# Altium project Zynq-Video-Board-Rev-1.2.PrjPCB (part 2 of 2)
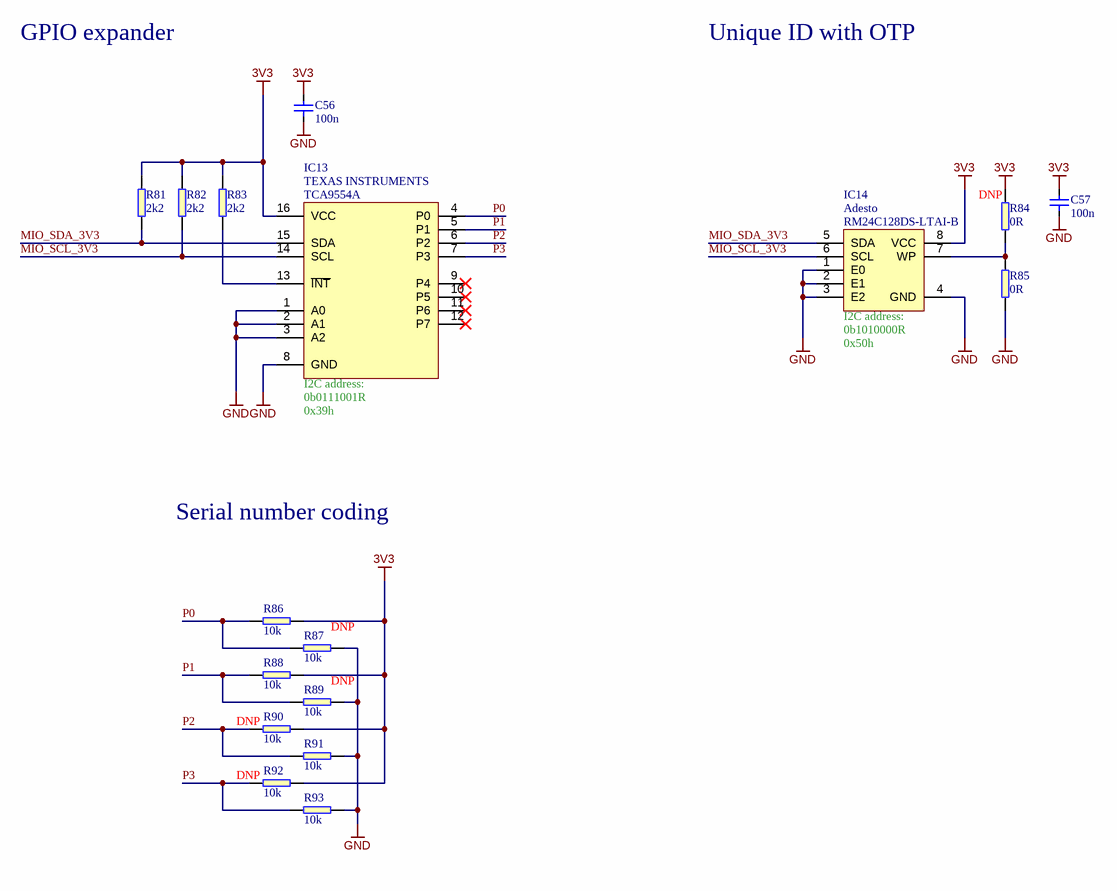
[diagram p9: [9]_ID_Serial.SchDoc]

## Nets that join several sheets
2V8: [1]_Power Supply (R2.2), [7]_CSI (IC10.1 IC10.8 IC12.1 IC12.8)
3V3: [1]_Power Supply (Q1.2 R9.2 R10.2), [2]_Ethernet_SDCard (11 pins), [3]_SO-DIMM (10 pins), [4]_USB (9 pins), [5]_HDMI (5 pins), [6]_Debug (9 pins), [7]_CSI (6 pins), [8]_Peripherals (8 pins), [9]_ID_Serial (12 pins)
3V3_MOD: [1]_Power Supply (L3.1 L6.1 L7.1 Q1.3), [3]_SO-DIMM (R20.2)
5V0: [1]_Power Supply (C1.2 IC1.1 IC1.3 R3.2), [3]_SO-DIMM (C58.2 FAN.1 R94.1), [4]_USB (C52.2 IC5.7), [5]_HDMI (C29.1 IC7.11), [6]_Debug (D3.2), [7]_CSI (J5.1 J5.2)
GND: [1]_Power Supply (27 pins), [2]_Ethernet_SDCard (6 pins), [3]_SO-DIMM (44 pins), [4]_USB (24 pins), [5]_HDMI (11 pins), [6]_Debug (41 pins), [7]_CSI (12 pins), [8]_Peripherals (24 pins), [9]_ID_Serial (15 pins)
VCC_CFG: [1]_Power Supply (L3.2), [3]_SO-DIMM (M1.137 M1.146)
VCC_IO_B34: [1]_Power Supply (L7.2), [3]_SO-DIMM (M1.53 M1.62 M1.73)
VCC_IO_B35: [1]_Power Supply (L6.2), [3]_SO-DIMM (M1.82 M1.117 M1.126), [5]_HDMI (8 pins)
AUX_JTAG_RST: [3]_SO-DIMM (M1.125), [6]_Debug (IC11.2)
AUX_JTAG_TCK: [3]_SO-DIMM (M1.135), [6]_Debug (IC9.2)
AUX_JTAG_TDI: [3]_SO-DIMM (M1.133), [6]_Debug (IC9.3)
AUX_JTAG_TDO: [3]_SO-DIMM (M1.131), [6]_Debug (IC9.4)
AUX_JTAG_TMS: [3]_SO-DIMM (M1.129), [6]_Debug (IC9.5)
BTN1: [3]_SO-DIMM (M1.148), [8]_Peripherals (R55.1)
BTN2: [3]_SO-DIMM (M1.154), [8]_Peripherals (R56.1)
BTN3: [3]_SO-DIMM (M1.150), [8]_Peripherals (R57.1)
BTN4: [3]_SO-DIMM (M1.152), [8]_Peripherals (R58.1)
CAM1_SCL: [3]_SO-DIMM (M1.97), [7]_CSI (IC12.11)
CAM1_SDA: [3]_SO-DIMM (M1.99), [7]_CSI (IC12.10)
CAM2_SCL: [3]_SO-DIMM (M1.84), [7]_CSI (IC12.13)
CAM2_SDA: [3]_SO-DIMM (M1.86), [7]_CSI (IC12.12)
CAM_RST: [3]_SO-DIMM (M1.134), [7]_CSI (IC10.13)
CN_B1_N: [3]_SO-DIMM (M1.80), [8]_Peripherals (D7.1 J6.10)
CN_B1_P: [3]_SO-DIMM (M1.78), [8]_Peripherals (D7.4 J6.9)
CN_B2_N: [3]_SO-DIMM (M1.76), [8]_Peripherals (D7.2 J6.4)
CN_B2_P: [3]_SO-DIMM (M1.74), [8]_Peripherals (D7.5 J6.3)
CN_B3_N: [3]_SO-DIMM (M1.70), [8]_Peripherals (D9.1 J6.8)
CN_B3_P: [3]_SO-DIMM (M1.68), [8]_Peripherals (D9.4 J6.7)
CN_B4_N: [3]_SO-DIMM (M1.66), [8]_Peripherals (D9.2 J6.2)
CN_B4_P: [3]_SO-DIMM (M1.64), [8]_Peripherals (D9.5 J6.1)
CN_C1_N: [3]_SO-DIMM (M1.61), [8]_Peripherals (D10.1 J7.10)
CN_C1_P: [3]_SO-DIMM (M1.59), [8]_Peripherals (D10.4 J7.9)
CN_C2_N: [3]_SO-DIMM (M1.57), [8]_Peripherals (D10.2 J7.4)
CN_C2_P: [3]_SO-DIMM (M1.55), [8]_Peripherals (D10.5 J7.3)
CN_C3_N: [3]_SO-DIMM (M1.51), [8]_Peripherals (D11.1 J7.8)
CN_C3_P: [3]_SO-DIMM (M1.49), [8]_Peripherals (D11.4 J7.7)
CN_C4_N: [3]_SO-DIMM (M1.45), [8]_Peripherals (D11.2 J7.2)
CN_C4_P: [3]_SO-DIMM (M1.43), [8]_Peripherals (D11.5 J7.1)
ETH_A_N: [2]_Ethernet_SDCard (J10.2), [3]_SO-DIMM (M1.169)
ETH_A_P: [2]_Ethernet_SDCard (J10.1), [3]_SO-DIMM (M1.171)
ETH_B_N: [2]_Ethernet_SDCard (J10.6), [3]_SO-DIMM (M1.177)
ETH_B_P: [2]_Ethernet_SDCard (J10.3), [3]_SO-DIMM (M1.179)
ETH_C_N: [2]_Ethernet_SDCard (J10.5), [3]_SO-DIMM (M1.183)
ETH_C_P: [2]_Ethernet_SDCard (J10.4), [3]_SO-DIMM (M1.185)
ETH_D_N: [2]_Ethernet_SDCard (J10.8), [3]_SO-DIMM (M1.191)
ETH_D_P: [2]_Ethernet_SDCard (J10.7), [3]_SO-DIMM (M1.193)
ETH_LED1n: [2]_Ethernet_SDCard (J10.14), [3]_SO-DIMM (M1.173)
ETH_LED2n: [2]_Ethernet_SDCard (J10.12), [3]_SO-DIMM (M1.175)
HP_CSI1_CLK_N: [3]_SO-DIMM (M1.114), [7]_CSI (J5.23 R25.1 R26.2)
HP_CSI1_CLK_P: [3]_SO-DIMM (M1.112), [7]_CSI (J5.22 R26.1 R28.1)
HP_CSI1_D0_N: [3]_SO-DIMM (M1.120), [7]_CSI (J5.26 R45.1 R47.2)
HP_CSI1_D0_P: [3]_SO-DIMM (M1.118), [7]_CSI (J5.25 R47.1 R49.1)
HP_CSI1_D1_N: [3]_SO-DIMM (M1.124), [7]_CSI (J5.28 R39.1 R41.2)
HP_CSI1_D1_P: [3]_SO-DIMM (M1.122), [7]_CSI (J5.27 R41.1 R43.1)
HP_CSI2_CLK_N: [3]_SO-DIMM (M1.130), [7]_CSI (J5.41 R96.1 R97.2)
HP_CSI2_CLK_P: [3]_SO-DIMM (M1.128), [7]_CSI (J5.40 R97.1 R98.1)
HP_CSI2_D0_N: [3]_SO-DIMM (M1.140), [7]_CSI (J5.44 R46.1 R48.2)
HP_CSI2_D0_P: [3]_SO-DIMM (M1.138), [7]_CSI (J5.43 R48.1 R50.1)
HP_CSI2_D1_N: [3]_SO-DIMM (M1.144), [7]_CSI (J5.46 R40.1 R42.2)
HP_CSI2_D1_P: [3]_SO-DIMM (M1.142), [7]_CSI (J5.45 R42.1 R44.1)
JTAG_TCK: [3]_SO-DIMM (M1.158), [6]_Debug (D5.11 J12.6 R32.2)
JTAG_TDI: [3]_SO-DIMM (M1.160), [6]_Debug (D5.8 J12.10 R33.2)
JTAG_TDO: [3]_SO-DIMM (M1.164), [6]_Debug (D5.9 J12.8 R34.2)
JTAG_TMS: [3]_SO-DIMM (M1.162), [6]_Debug (D5.12 J12.4 R35.2)
LED1: [3]_SO-DIMM (M1.44), [8]_Peripherals (R59.8)
LED2: [3]_SO-DIMM (M1.46), [8]_Peripherals (R59.7)
LED3: [3]_SO-DIMM (M1.48), [8]_Peripherals (R59.6)
LED4: [3]_SO-DIMM (M1.50), [8]_Peripherals (R59.5)
LED5: [3]_SO-DIMM (M1.54), [8]_Peripherals (R59.4)
LED6: [3]_SO-DIMM (M1.56), [8]_Peripherals (R59.3)
LED7: [3]_SO-DIMM (M1.69), [8]_Peripherals (R59.2)
LED8: [3]_SO-DIMM (M1.71), [8]_Peripherals (R59.1)
LP_CSI1_CLK_N: [3]_SO-DIMM (M1.113), [7]_CSI (R25.2)
LP_CSI1_CLK_P: [3]_SO-DIMM (M1.115), [7]_CSI (R28.2)
LP_CSI1_D0_N: [3]_SO-DIMM (M1.108), [7]_CSI (R45.2)
LP_CSI1_D0_P: [3]_SO-DIMM (M1.110), [7]_CSI (R49.2)
LP_CSI1_D1_N: [3]_SO-DIMM (M1.102), [7]_CSI (R39.2)
LP_CSI1_D1_P: [3]_SO-DIMM (M1.104), [7]_CSI (R43.2)
LP_CSI2_CLK_N: [3]_SO-DIMM (M1.119), [7]_CSI (R96.2)
LP_CSI2_CLK_P: [3]_SO-DIMM (M1.121), [7]_CSI (R98.2)
LP_CSI2_D0_N: [3]_SO-DIMM (M1.96), [7]_CSI (R46.2)
LP_CSI2_D0_P: [3]_SO-DIMM (M1.98), [7]_CSI (R50.2)
LP_CSI2_D1_N: [3]_SO-DIMM (M1.90), [7]_CSI (R40.2)
LP_CSI2_D1_P: [3]_SO-DIMM (M1.92), [7]_CSI (R44.2)
MIO_SCL_3V3: [3]_SO-DIMM (M1.178), [5]_HDMI (IC7.2), [9]_ID_Serial (IC13.14 IC14.6 R82.1)
MIO_SDA_3V3: [3]_SO-DIMM (M1.176), [5]_HDMI (IC7.3), [9]_ID_Serial (IC13.15 IC14.5 R81.1)
PWR_GOOD: [1]_Power Supply (Q2.1), [3]_SO-DIMM (M1.40)
SDIO_CD#: [2]_Ethernet_SDCard (J9.9 R62.1), [3]_SO-DIMM (M1.67)
SDIO_CLK: [2]_Ethernet_SDCard (D12.11 J9.5 R65.1), [3]_SO-DIMM (M1.139)
SDIO_CMD: [2]_Ethernet_SDCard (D12.12 J9.3 R66.1), [3]_SO-DIMM (M1.141)
SDIO_D0: [2]_Ethernet_SDCard (D12.9 J9.7 R64.1), [3]_SO-DIMM (M1.143)
SDIO_D1: [2]_Ethernet_SDCard (D12.8 J9.8 R63.1), [3]_SO-DIMM (M1.145)
SDIO_D2: [2]_Ethernet_SDCard (D12.14 J9.1 R68.1), [3]_SO-DIMM (M1.149)
SDIO_D3: [2]_Ethernet_SDCard (D12.13 J9.2 R67.1), [3]_SO-DIMM (M1.151)
SRST_RDYn: [3]_SO-DIMM (5 pins), [6]_Debug (D5.13 J12.14 R36.2)
TMDS_CLK_N: [3]_SO-DIMM (M1.87), [5]_HDMI (IC7.15 J11.12 R70.1)
TMDS_CLK_P: [3]_SO-DIMM (M1.85), [5]_HDMI (IC7.16 J11.10 R71.1)
TMDS_D0_N: [3]_SO-DIMM (M1.93), [5]_HDMI (IC7.17 J11.9 R72.1)
TMDS_D0_P: [3]_SO-DIMM (M1.91), [5]_HDMI (IC7.18 J11.7 R73.1)
TMDS_D1_N: [3]_SO-DIMM (M1.81), [5]_HDMI (IC7.20 J11.6 R74.1)
TMDS_D1_P: [3]_SO-DIMM (M1.79), [5]_HDMI (IC7.21 J11.4 R75.1)
TMDS_D2_N: [3]_SO-DIMM (M1.77), [5]_HDMI (IC7.22 J11.3 R76.1)
TMDS_D2_P: [3]_SO-DIMM (M1.75), [5]_HDMI (IC7.23 J11.1 R77.1)
TMDS_HPD: [3]_SO-DIMM (M1.132), [6]_Debug (IC11.3)
TMDS_HPD_3V3: [5]_HDMI (Q3.3 R29.1), [6]_Debug (IC11.12)
UART1_RX: [3]_SO-DIMM (M1.153), [6]_Debug (IC8.38)
UART1_TX: [3]_SO-DIMM (M1.155), [6]_Debug (IC8.39)
UART2_RX: [3]_SO-DIMM (M1.60), [6]_Debug (IC8.48)
UART2_TX: [3]_SO-DIMM (M1.58), [6]_Debug (IC8.52)
USB_UP_N: [3]_SO-DIMM (M1.161), [4]_USB (IC6.19)
USB_UP_P: [3]_SO-DIMM (M1.159), [4]_USB (IC6.20)

## Assembly variants
Production: not fitted R8 R70 R71 R72 R73 R74 R75 R76 R77 R84 R87 R89 R90 R92